# Altium schematic sheet BMU control.SchDoc
size A4
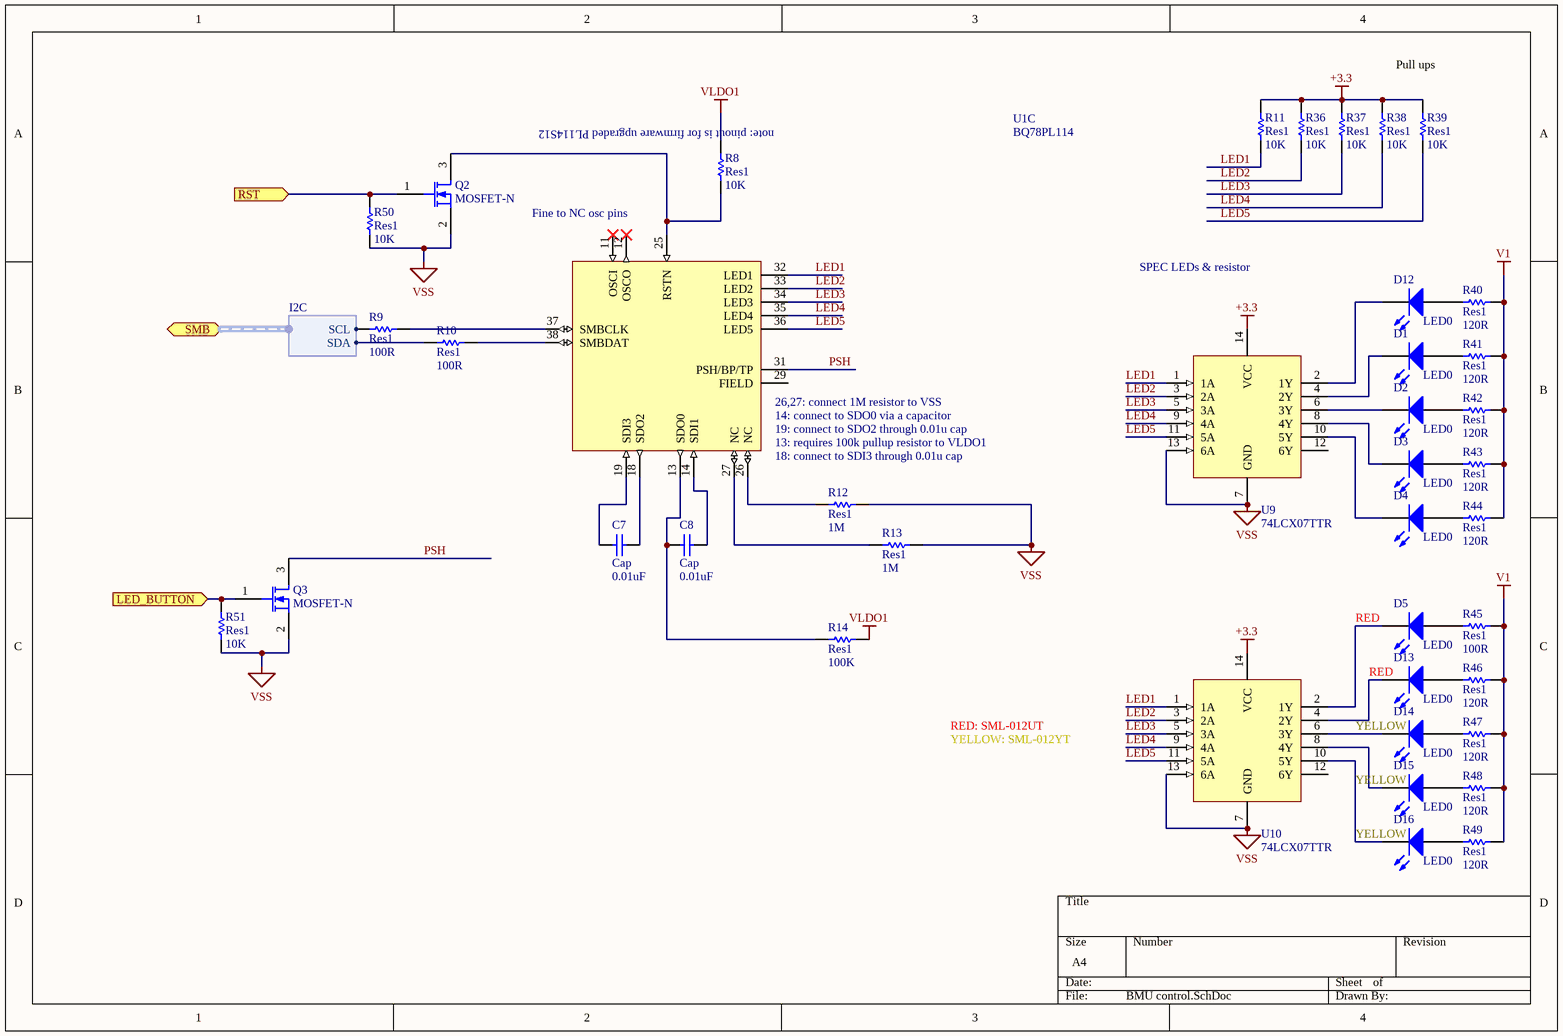
[diagram p0: BMU control.SchDoc]

## Parts
C7  Cap  value 0.01uF  [C0805]
C8  Cap  value 0.01uF  [C0805]
D1  LED0  [SML-01 (ROHM LED SERIES)]
D2  LED0  [SML-01 (ROHM LED SERIES)]
D3  LED0  [SML-01 (ROHM LED SERIES)]
D4  LED0  [SML-01 (ROHM LED SERIES)]
D5  LED0  colour: RED  [SML-01 (ROHM LED SERIES)]
D12  LED0  [SML-01 (ROHM LED SERIES)]
D13  LED0  colour: RED  [SML-01 (ROHM LED SERIES)]
D14  LED0  colour: YELLOW  [SML-01 (ROHM LED SERIES)]
D15  LED0  colour: YELLOW  [SML-01 (ROHM LED SERIES)]
D16  LED0  colour: YELLOW  [SML-01 (ROHM LED SERIES)]
Q2  MOSFET-N  [2N7002]
Q3  MOSFET-N  [2N7002]
R8  Res1  value 10K  [R0603]
R9  Res1  value 100R  [R0603]
R10  Res1  value 100R  [R0603]
R11  Res1  value 10K  [R0603]
R12  Res1  value 1M  [R0603]
R13  Res1  value 1M  [R0603]
R14  Res1  value 100K  [R0603]
R36  Res1  value 10K  [R0603]
R37  Res1  value 10K  [R0603]
R38  Res1  value 10K  [R0603]
R39  Res1  value 10K  [R0603]
R40  Res1  value 120R  [R0603]
R41  Res1  value 120R  [R0603]
R42  Res1  value 120R  [R0603]
R43  Res1  value 120R  [R0603]
R44  Res1  value 120R  [R0603]
R45  Res1  value 100R  [R0603]
R46  Res1  value 120R  [R0603]
R47  Res1  value 120R  [R0603]
R48  Res1  value 120R  [R0603]
R49  Res1  value 120R  [R0603]
R50  Res1  value 10K  [R0603]
R51  Res1  value 10K  [R0603]
U1  BQ78PL114  [QFN50P700X700X100-48N]  (part C of 3)
U9  74LCX07TTR  [74LCX07TTR]
U10  74LCX07TTR  [74LCX07TTR]

## Ports
LED_BUTTON (in), RST (in), SMB (harness I2C)

## Harnesses
I2C: SCL, SDA

## Nets
+3.3: R11.2 R36.2 R37.2 R38.2 R39.2 U9.14(VCC) U10.14(VCC)
V1: R40.1 R41.1 R42.1 R43.1 R44.1 R45.1 R46.1 R47.1 R48.1 R49.1
VLDO1: R8.1 R14.2
VSS: Q2.2(S) Q3.2(S) R12.2 R13.2 R50.1 R51.1 U9.7(GND) U9.13(6A) U10.7(GND) U10.13(6A)
LED1: R11.1 U1.32(LED1) U9.1(1A) U10.1(1A)
LED2: R36.1 U1.33(LED2) U9.3(2A) U10.3(2A)
LED3: R37.1 U1.34(LED3) U9.5(3A) U10.5(3A)
LED4: R38.1 U1.35(LED4) U9.9(4A) U10.9(4A)
LED5: R39.1 U1.36(LED5) U9.11(5A) U10.11(5A)
LED_BUTTON: Q3.1(G) R51.2 ; port LED_BUTTON
PSH: Q3.3(D) U1.31(PSH/BP/TP)
RST: Q2.1(G) R50.2 ; port RST
NetC7_1: C7.1 U1.19(SDI3)
NetC7_2: C7.2 U1.18(SDO2)
NetC8_1: C8.1 R14.1 U1.13(SDO0)
NetC8_2: C8.2 U1.14(SDI1)
NetD1_1: D1.1(A) R41.2
NetD1_2: D1.2(K) U9.4(2Y)
NetD2_1: D2.1(A) R42.2
NetD2_2: D2.2(K) U9.6(3Y)
NetD3_1: D3.1(A) R43.2
NetD3_2: D3.2(K) U9.8(4Y)
NetD4_1: D4.1(A) R44.2
NetD4_2: D4.2(K) U9.10(5Y)
NetD5_1: D5.1(A) R45.2
NetD5_2: D5.2(K) U10.2(1Y)
NetD12_1: D12.1(A) R40.2
NetD12_2: D12.2(K) U9.2(1Y)
NetD13_1: D13.1(A) R46.2
NetD13_2: D13.2(K) U10.4(2Y)
NetD14_1: D14.1(A) R47.2
NetD14_2: D14.2(K) U10.6(3Y)
NetD15_1: D15.1(A) R48.2
NetD15_2: D15.2(K) U10.8(4Y)
NetD16_1: D16.1(A) R49.2
NetD16_2: D16.2(K) U10.10(5Y)
NetQ2_3: Q2.3(D) R8.2 U1.25(RSTN)
NetR9_1: R9.1 ; port SMB.SCL
NetR9_2: R9.2 U1.37(SMBCLK)
NetR10_1: R10.1 ; port SMB.SDA
NetR10_2: R10.2 U1.38(SMBDAT)
NetR12_1: R12.1 U1.26(NC)
NetR13_1: R13.1 U1.27(NC)

Not connected (* = marked no-connect by the designer): U1 11(OSCI)* 12(OSCO)* 29(FIELD); U9 12(6Y); U10 12(6Y)

## Notes on the sheet
- Pull ups
- (near U1) Fine to NC osc pins
- SPEC LEDs & resistor
- RED: SML-012UT
- YELLOW: SML-012YT
- (in symbol BQ78PL114, part C) note: pinout is for firmware upgraded PL114S12; 26,27: connect 1M resistor to VSS; 14: connect to SDO0 via a capacitor; 19: connect to SDO2 through 0.01u cap; 13: requires 100k pullup resistor to VLDO1; 18: connect to SDI3 through 0.01u cap

## Library data of the parts
C7 C8 = Cap: Capacitor; Published: 8-Jun-2000; LatestRevisionDate: 17-Jul-2002; LatestRevisionNote: Re-released for DXP Platform.; PackageReference: RAD-0.3; Publisher: Altium Limited; farnell: 1793837
Q2 Q3 = 2N7002: NXP - 2N7002 - MOSFET,N CH, 60V,0.3A,SOT23; farnell: 1510761
R8-R14 R36-R51 = Res1: Resistor; Published: 8-Jun-2000; LatestRevisionDate: 17-Jul-2002; LatestRevisionNote: Re-released for DXP Platform.; PackageReference: AXIAL-0.3; Publisher: Altium Limited
  R8 R11 R36-R39 R50 R51: farnell: 1576297
  R9 R10 R45: farnell: 9330364
  R12 R13: farnell: 9330410
  R14: farnell: 9330402
  R40-R44 R46-R49: farnell: 9330496
U1 = BQ78PL114: IC, BATT MANAGEMENT CONTRL, 48QFN; farnell: 1684746; digikey: 296-23814-1-ND
U9 U10 = 74LCX07TTR: STMICROELECTRONICS - 74LCX07TTR - IC, HEX BUFFER, SMD, TSSOP14; farnell: 1288488
D1-D5 D12-D16 = LED0: Published: 8-Jun-2000; LatestRevisionDate: 08-Jul-2005; LatestRevisionNote: Mech Layer 1 removed.; PackageReference: LED-0; Publisher: Altium Limited
  D1 D5 D12 D13: farnell: 1685047
  D2-D4 D14-D16: farnell: 1685048